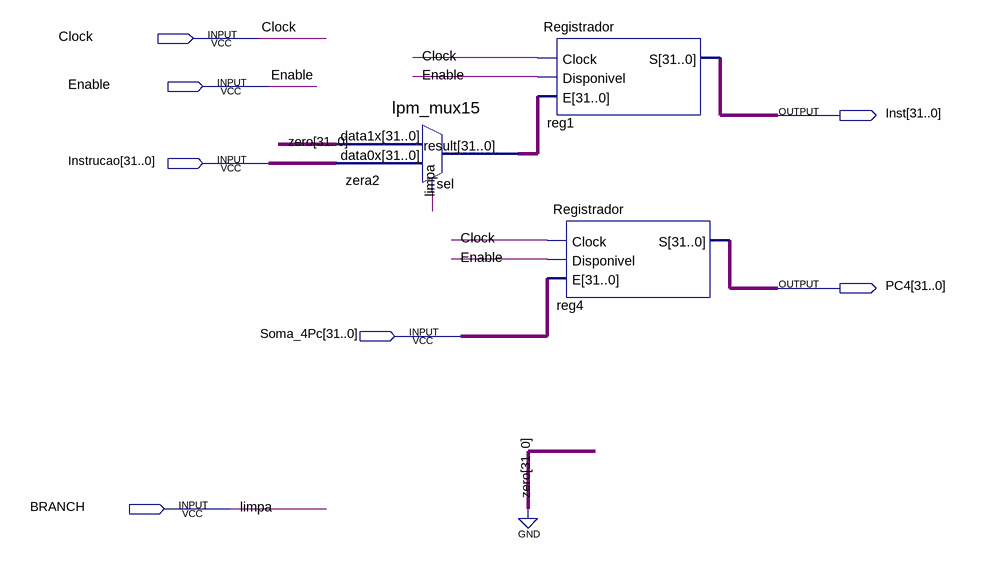
[diagram p0: schematic sheet]
// Quartus schematic IF_ID.bdf as structural Verilog: 3 symbols, 7 pins
module IF_ID (
  input  Clock,
  input  Enable,
  input  [31:0] Instrucao,
  input  [31:0] Soma_4Pc,
  input  BRANCH,
  output [31:0] Inst,
  output [31:0] PC4
);

  wire [31:0] zera2_result;

  lpm_mux15 zera2 (.data1x({32{1'b0}}), .data0x(Instrucao), .sel(BRANCH), .result(zera2_result));
  Registrador reg1 (.Clock(Clock), .Disponivel(Enable), .E(zera2_result), .S(Inst));
  Registrador reg4 (.Clock(Clock), .Disponivel(Enable), .E(Soma_4Pc), .S(PC4));

  // Other names for the same wires on the sheet: limpa = BRANCH
endmodule
